# Altium schematic sheet put_in_test.SchDoc
size A4
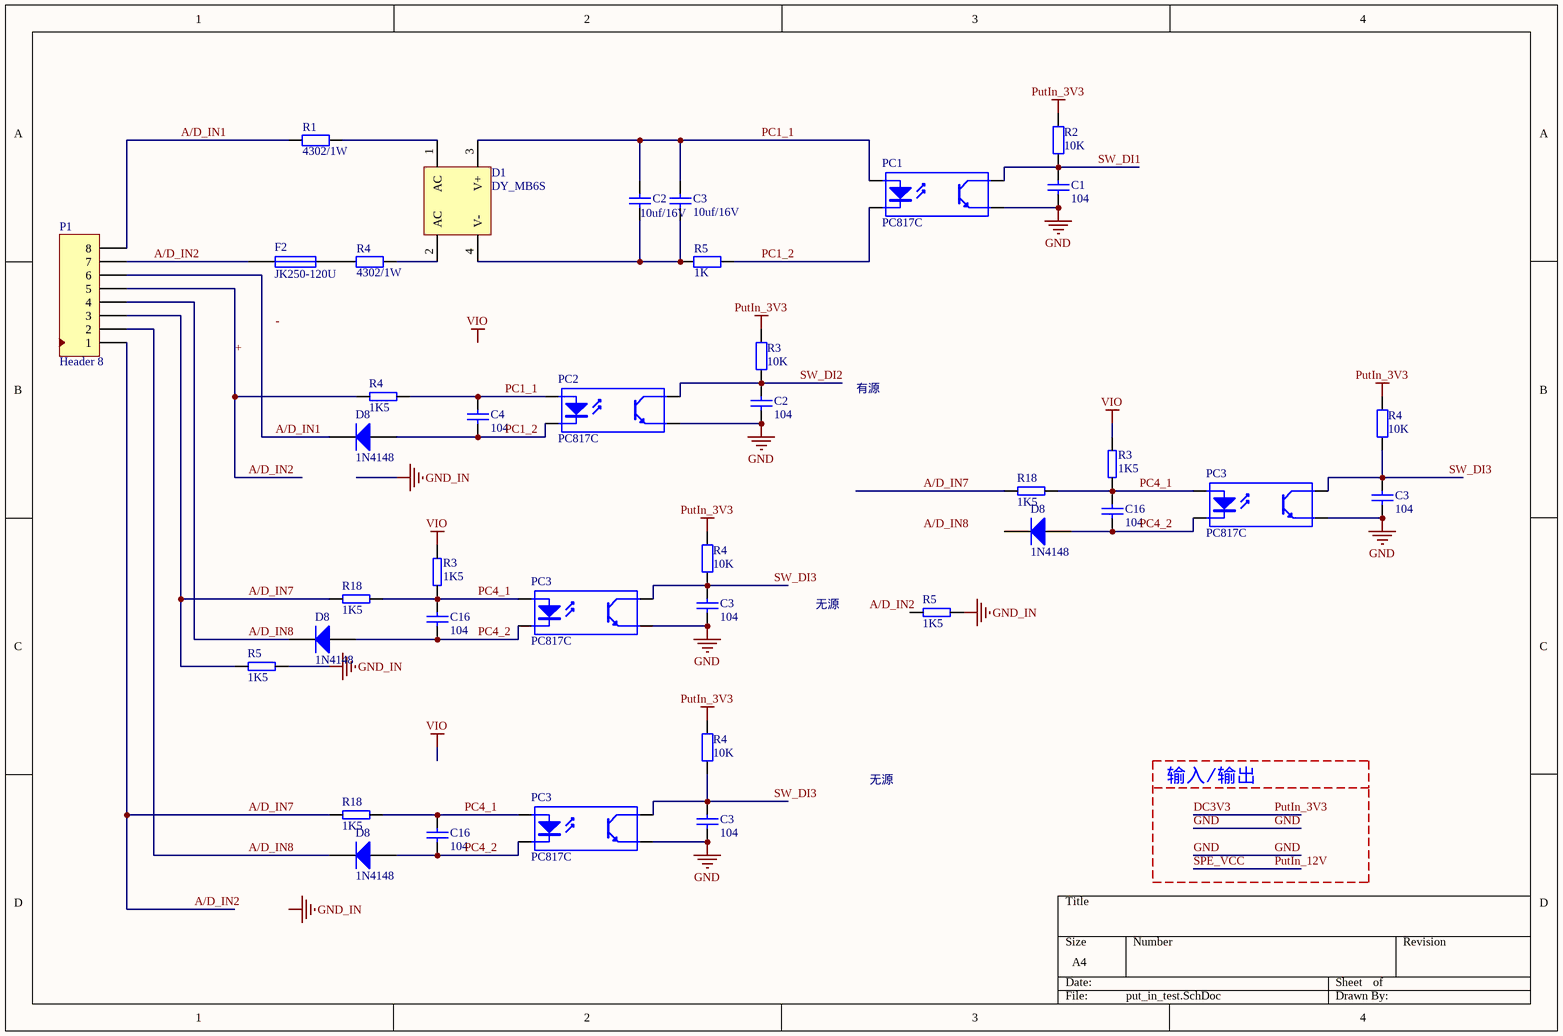
[diagram p0: put_in_test.SchDoc]

## Parts
(Parts that share a designator on the sheet are numbered #1, #2 ... from top to bottom, then left to right.)
C1  104  [LC-0603_C]
C2#1  10uf/16V  [LC-0805_C]
C2#2  104  [LC-0603_C]
C3#1  10uf/16V  [LC-0805_C]
C3#2  104  [LC-0603_C]
C3#3  104  [LC-0603_C]
C3#4  104  [LC-0603_C]
C4  104  [LC-0603_C]
C16#1  104  [LC-0603_C]
C16#2  104  [LC-0603_C]
C16#3  104  [LC-0603_C]
D1  DY_MB6S  [LC-MBS]
D8#1  1N4148  [LC-LL-34]
D8#2  1N4148  [LC-LL-34]
D8#3  1N4148  [LC-LL-34]
D8#4  1N4148  [LC-LL-34]
F2  JK250-120U  [ntc250v]
P1  Header 8  [5.08-8p]
PC1  PC817C  [LC-SMD-4]
PC2  PC817C  [LC-SMD-4]
PC3#1  PC817C  [LC-SMD-4]
PC3#2  PC817C  [LC-SMD-4]
PC3#3  PC817C  [LC-SMD-4]
R1  4302/1W  [LC-2512_R]
R2  10K  [LC-0603_R]
R3#1  10K  [LC-0603_R]
R3#2  1K5  [LC-0603_R]
R3#3  1K5  [LC-0603_R]
R4#1  4302/1W  [LC-2512_R]
R4#2  1K5  [LC-0603_R]
R4#3  10K  [LC-0603_R]
R4#4  10K  [LC-0603_R]
R4#5  10K  [LC-0603_R]
R5#1  1K  [LC-0603_R]
R5#2  1K5  [LC-0603_R]
R5#3  1K5  [LC-0603_R]
R18#1  1K5  [LC-0603_R]
R18#2  1K5  [LC-0603_R]
R18#3  1K5  [LC-0603_R]

## Nets
DC3V3: R2.2 R3#1.2 R4#3.2 R4#4.2 R4#5.2  [also labelled PutIn_3V3]
GND: C1.2 C2#2.2 C3#2.2 C3#3.2 C3#4.2 PC1.3(E) PC2.3(E) PC3#1.3(E) PC3#2.3(E) PC3#3.3(E)
GND_IN: R5#2.1 R5#3.1
VIO: R3#2.1 R3#3.1
+: F2.1 P1.1 P1.3 P1.5 P1.7 R4#2.2 R5#3.2 R18#1.2 R18#2.2 R18#3.2  [also labelled A/D_IN2, A/D_IN7]
A/D_IN1: D8#1.2(K) P1.6 P1.8 R1.1
A/D_IN8: D8#3.2(K) D8#4.2(K) P1.2 P1.4
PC1_1: C2#1.2 C3#1.2 C4.1 D1.3(V+) PC1.1(A) PC2.1(A) R4#2.1
PC1_2: C4.2 D8#1.1(A) PC1.2(K) PC2.2(K) R5#1.1
PC4_1: C16#1.1 C16#2.1 C16#3.1 PC3#1.1(A) PC3#2.1(A) PC3#3.1(A) R3#2.2 R3#3.2 R18#1.1 R18#2.1 R18#3.1
PC4_2: C16#1.2 C16#2.2 C16#3.2 D8#2.1(A) D8#3.1(A) D8#4.1(A) PC3#1.2(K) PC3#2.2(K) PC3#3.2(K)
SW_DI1: C1.1 PC1.4(C) R2.1
SW_DI2: C2#2.1 PC2.4(C) R3#1.1
SW_DI3: C3#2.1 C3#3.1 C3#4.1 PC3#1.4(C) PC3#2.4(C) PC3#3.4(C) R4#3.1 R4#4.1 R4#5.1
NetC2#1_1: C2#1.1 C3#1.1 D1.4(V-) R5#1.2
NetD1_1: D1.1(AC) R1.2
NetD1_2: D1.2(AC) R4#1.2
NetF2_2: F2.2 R4#1.1

Not connected (* = marked no-connect by the designer): D8#2 2(K); R5#2 2

## Notes on the sheet
- 有源
- 无源
- 输入/输出
- Labels drawn without touching a wire or pin: -, A/D_IN2, A/D_IN8, GND_IN, VIO

## Library data of the parts
C1 C2#1 C2#2 C3#1-C3#4 = Cap: Capacitor; Value: 100pF; Published: 8-Jun-2000; LatestRevisionDate: 17-Jul-2002; LatestRevisionNote: Re-released for DXP Platform.; PackageReference: RAD-0.3; Publisher: Altium Limited; PackageDescription: Radial Cap, Thru-Hole; 2 Leads; 0.3 in Pin Spacing
C4 C16#1-C16#3 = Cap: Capacitor; Value: 100nF; Published: 8-Jun-2000; Revision: July-2002: Re-released for DXP Platform.; Publisher: Altium Limited
D1 = BRIDGE2: Diode Bridge; pin to pad: 2>3 3>2
D8#1-D8#4 = Diode: Default Diode; Published: 8-Jun-2000; LatestRevisionDate: 17-Jul-2002; LatestRevisionNote: Re-released for DXP Platform.; PackageDocument: Sep-1996; PackageReference: SMC; Publisher: Altium Limited; Code_JEDEC: DO-214-AB
F2 = Fus: 保险丝; Value: 1A
P1 = Header 8: 接插件; LatestRevisionDate: 17-Jul-2002; LatestRevisionNote: Re-released for DXP Platform.; Publisher: Altium Limited
PC1 PC2 PC3#1-PC3#3 = Optoisolator1: 4-Pin Phototransistor Optocoupler; Published: 24-Mar-1999; LatestRevisionDate: 04-Mar-2005; LatestRevisionNote: Sch pins 3 & 4 Swapped.; DatasheetVersion: Nov-2003; PackageReference: DIP-4; Publisher: Altium Limited
R1 R2 R3#1 R4#1 R4#3-R4#5 = Res2: Resistor; Value: 1K; Published: 8-Jun-2000; LatestRevisionDate: 17-Jul-2002; LatestRevisionNote: Re-released for DXP Platform.; PackageReference: AXIAL-0.4; Publisher: Altium Limited; PackageDescription: Axial Device, Thru-Hole; 2 Leads; 0.4 in Pin Spacing
R3#2 R3#3 R4#2 R5#2 R5#3 R18#1-R18#3 = RES2
R5#1 = Res2: Resistor; Published: 8-Jun-2000; LatestRevisionDate: 17-Jul-2002; LatestRevisionNote: Re-released for DXP Platform.; PackageReference: AXIAL-0.4; Publisher: Altium Limited; PackageDescription: Axial Device, Thru-Hole; 2 Leads; 0.4 in Pin Spacing; Value: 1K